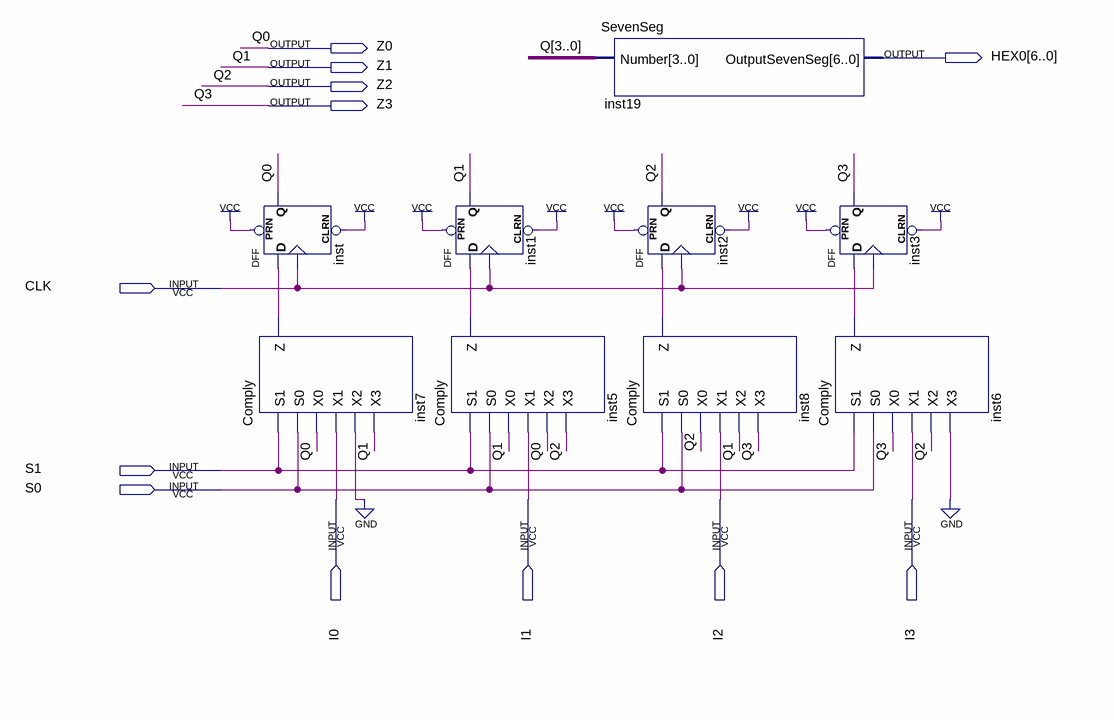
[diagram p0: schematic sheet]
// Quartus schematic Lab07.bdf as structural Verilog: 9 symbols, 12 pins
module Lab07 (
  input  CLK,
  input  S1,
  input  S0,
  input  I0,
  input  I1,
  input  I2,
  input  I3,
  output Z0,
  output [6:0] HEX0,
  output Z1,
  output Z2,
  output Z3
);

  wire inst5_z, inst6_z, inst7_z, inst8_z;

  DFF inst (.CLRN(1'b1), .CLK(CLK), .D(inst7_z), .PRN(1'b1), .Q(Z0));
  Comply inst7 (.S1(S1), .S0(S0), .X0(Z0), .X1(I0), .X2(1'b0), .X3(Z1), .Z(inst7_z));
  DFF inst1 (.CLRN(1'b1), .CLK(CLK), .D(inst5_z), .PRN(1'b1), .Q(Z1));
  Comply inst5 (.S1(S1), .S0(S0), .X0(Z1), .X1(I1), .X2(Z0), .X3(Z2), .Z(inst5_z));
  SevenSeg inst19 (.Number({Z3, Z2, Z1, Z0}), .OutputSevenSeg(HEX0));
  DFF inst2 (.CLRN(1'b1), .CLK(CLK), .D(inst8_z), .PRN(1'b1), .Q(Z2));
  Comply inst8 (.S1(S1), .S0(S0), .X0(Z2), .X1(I2), .X2(Z1), .X3(Z3), .Z(inst8_z));
  DFF inst3 (.CLRN(1'b1), .CLK(CLK), .D(inst6_z), .PRN(1'b1), .Q(Z3));
  Comply inst6 (.S1(S1), .S0(S0), .X0(Z3), .X1(I3), .X2(Z2), .X3(1'b0), .Z(inst6_z));

  // Other names for the same wires on the sheet: Q[3:0] = {Z3, Z2, Z1, Z0}; Q0 = Z0; Q1 = Z1; Q2 = Z2; Q3 = Z3
endmodule
